# EAGLE design CanBus-Forward (EAGLE 7.4.0)
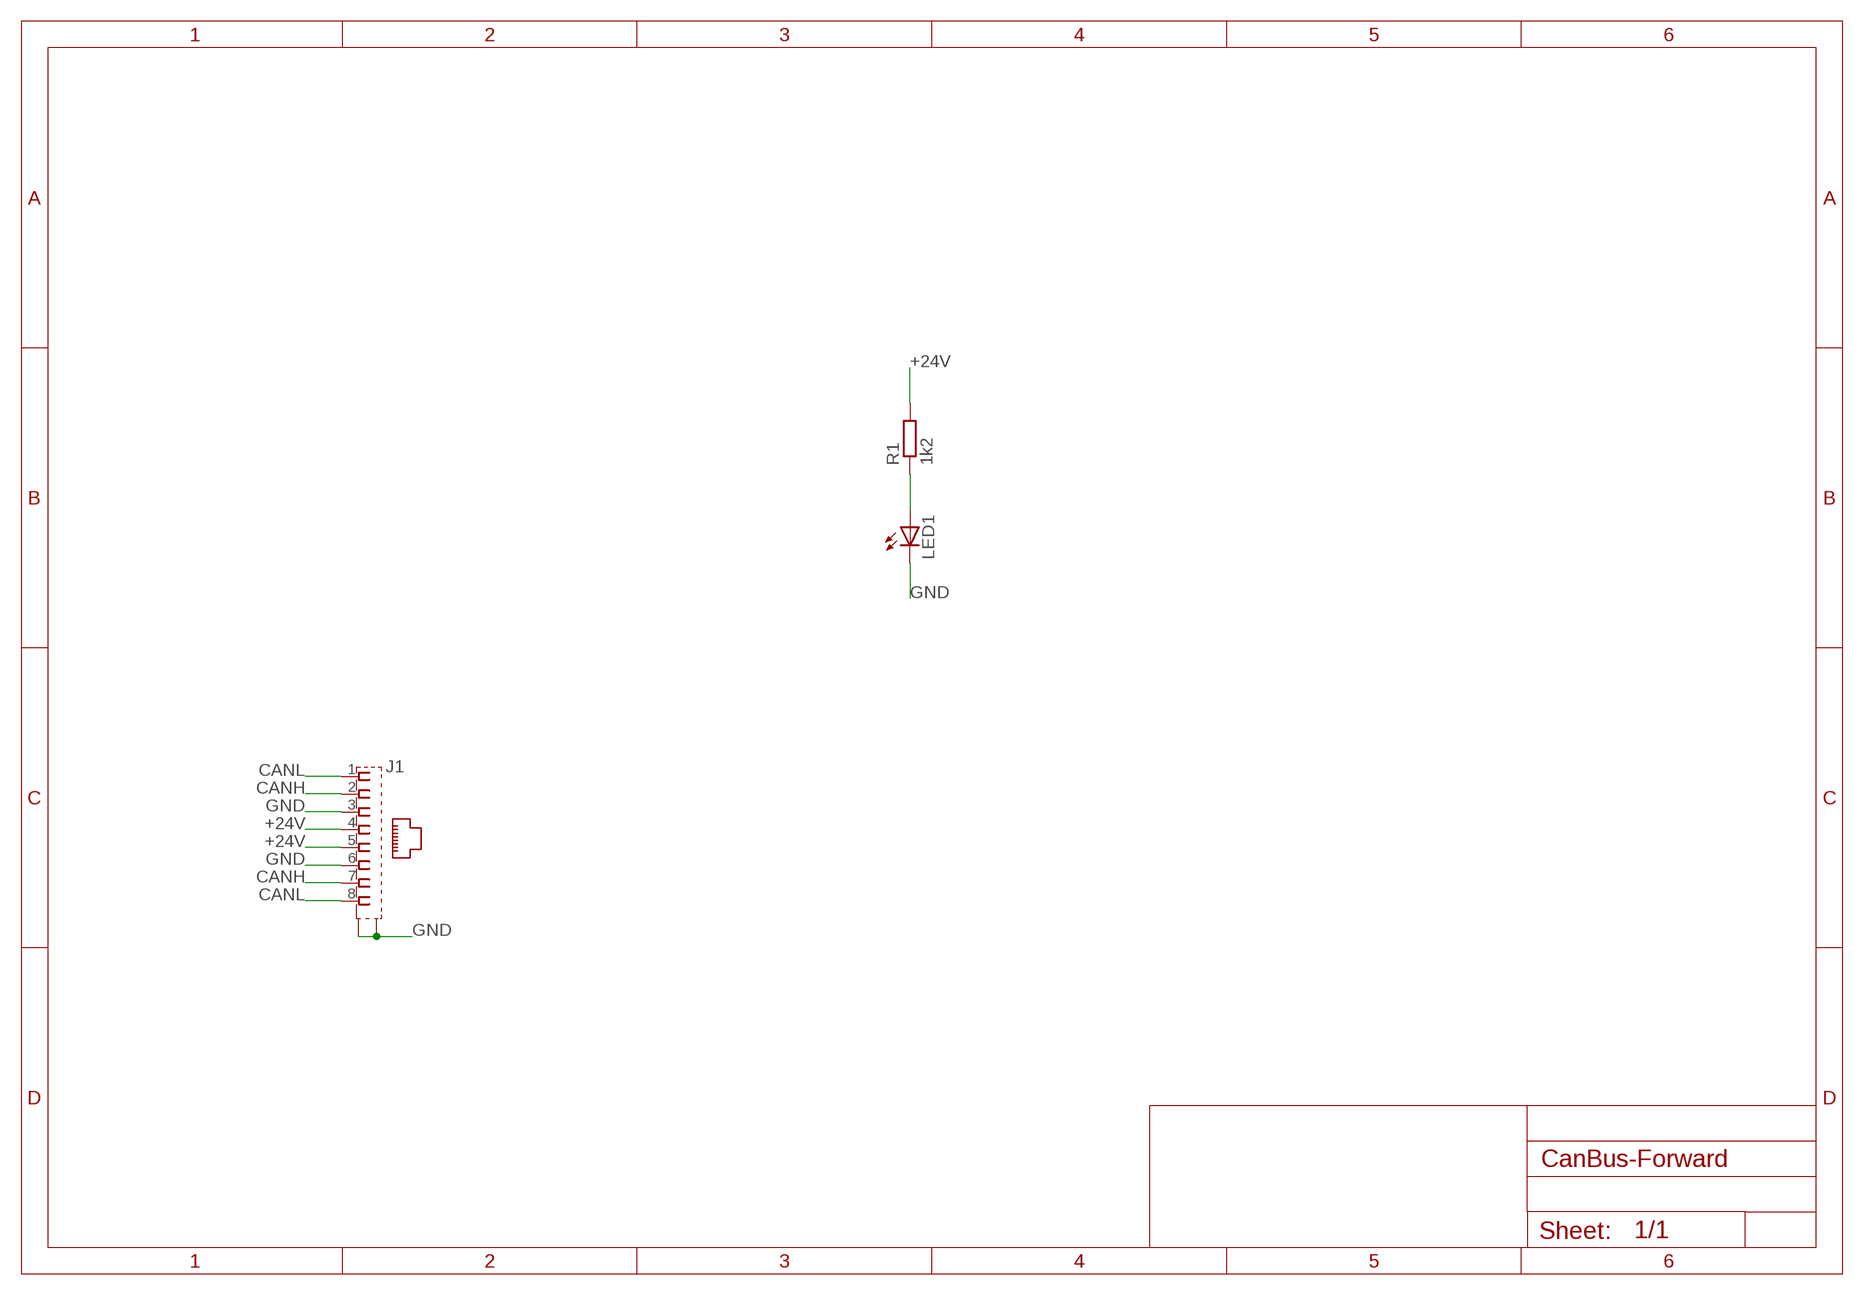
[diagram p0: schematic, sheet 1]

## Parts
J1  555141-1  [MEBP_8-8G]
LED1  LEDCHIPLED_1206  [CHIPLED_1206]
R1  1k2  R-EU_R1206  [R1206]

## Nets
+24V: J1.4 J1.5 R1.2
CANH: J1.2 J1.7
CANL: J1.1 J1.8
GND: J1.3 J1.6 J1.G1(S1) J1.G2(S2) LED1.C
N$2: LED1.A R1.1

## Library data of the parts
J1 = mebp_8-8g:555141-1: AMP connector Reichelt Bestell-Nr. MEBP 8-8G
LED1 = led:LED: LED OSRAM: - CHIPLED LG R971, LG N971, LY N971, LG Q971, LY Q971, LO R971, LY R971 LH N974, LH R974 LS Q976, LO Q976, LY Q976 LO Q996 - Hyper CHIPLED LW Q18S LB Q993, LB Q99A, LB R99A - SideLED LS A670, LO A670, LY A670, LG A670, LP A670 LB A673, LV A673, LT A673, LW A673 LH A674 LY A675 LS A676, LA A676, LO A676, LY A676, LW A676 LS A679, LY A679, LG A679 - Hyper Micro SIDELED® LS Y876, LA Y876, LO Y876, LY Y876 LT Y87S - SmartLED LW L88C, LW L88S LB L89C, LB L89S, LG L890 LS L89K, LO L89K, LY L89K LS L896, LA L896, LO L896, LY L896 - TOPLED LS T670, LO T670, LY T670, LG T670, LP T670 LSG T670, LSP T670, LSY T670, LOP T670, LYG T670 LG T671, LOG T671, LSG T671 LB T673, LV T673, LT T673, LW T673 LH T674 LS T676, LA T676, LO T676, LY T676, LB T676, LH T676, LSB T676, LW T676 LB T67C, LV T67C, LT T67C, LS T67K, LO T67K, LY T67K, LW E67C LS E67B, LA E67B, LO E67B, LY E67B, LB E67C, LV E67C, LT E67C LW T67C LS T679, LY T679, LG T679 LS T770, LO T770, LY T770, LG T770, LP T770 LB T773, LV T773, LT T773, LW T773 LH T774 LS E675, LA E675, LY E675, LS T675 LS T776, LA T776, LO T776, LY T776, LB T776 LHGB T686 LT T68C, LB T68C - Hyper Mini TOPLED® LB M676 - Mini TOPLED Santana® LG M470 LS M47K, LO M47K, LY M47K Source: http://www.osram.convergy.de LUXEON: - LUMILED® LXK2-PW12-R00, LXK2-PW12-S00, LXK2-PW14-U00, LXK2-PW14-V00 LXK2-PM12-R00, LXK2-PM12-S00, LXK2-PM14-U00 LXK2-PE12-Q00, LXK2-PE12-R00, LXK2-PE12-S00, LXK2-PE14-T00, LXK2-PE14-U00 LXK2-PB12-K00, LXK2-PB12-L00, LXK2-PB12-M00, LXK2-PB14-N00, LXK2-PB14-P00, LXK2-PB14-Q00 LXK2-PR12-L00, LXK2-PR12-M00, LXK2-PR14-Q00, LXK2-PR14-R00 LXK2-PD12-Q00, LXK2-PD12-R00, LXK2-PD12-S00 LXK2-PH12-R00, LXK2-PH12-S00 LXK2-PL12-P00, LXK2-PL12-Q00, LXK2-PL12-R00 Source: www.luxeon.com KINGBRIGHT: KA-3528ASYC Source: www.kingbright.com
R1 = rcl:R-EU_: RESISTOR, European symbol

## Board
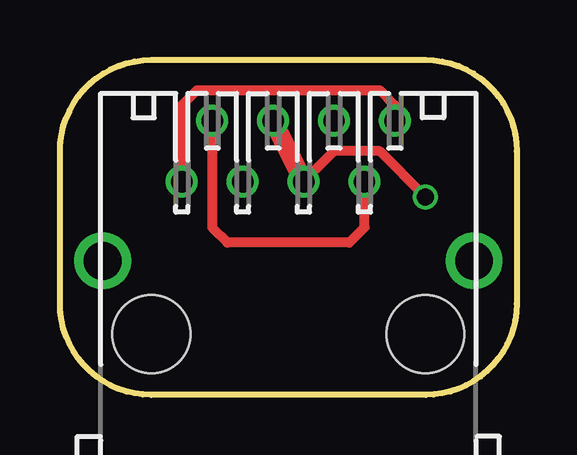
[diagram p1: board, top side]
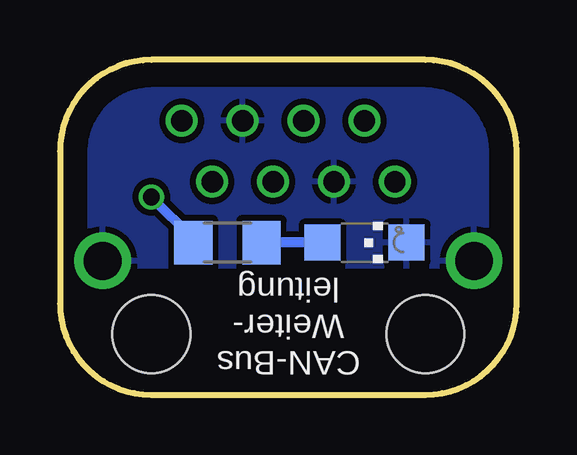
[diagram p2: board, bottom side, seen from below]

Size 19.05 x 13.97 mm. Coordinates in mm from the lower left corner, seen from the top.
Outline: 0,10.16 arc-90 3.81,13.97 15.24,13.97 arc-90 19.05,10.16 19.05,3.81 arc-90 15.24,0 3.81,0 arc-90 0,3.81 0,10.16
Copper layers (1*16): Top 0.035559375mm / dielectric 1.6mm / Bottom 0.035559375mm
Design rules "oshpark-2layer": minimum track width 6mil, minimum drill 10mil, track to track 6mil, track to pad 6mil, pad to pad 6mil, via to via 6mil, smd to smd 6mil, copper to edge 15mil, drill to drill 6mil, minimum pad ring 5mil, minimum via ring 5mil, stop-mask expansion 2.5mil, vias tented up to drill 0mil, thermal gap 10mil

### Footprints (pad centres in the part's own frame; a part is rotated, then mirrored left to right if it is on the bottom)
MEBP_8-8G = drill 0.889: 1 -4.445,6.35; 2 -3.175,8.89; 3 -1.905,6.35; 4 -0.635,8.89; 5 0.635,6.35; 6 1.905,8.89; 7 3.175,6.35; 8 4.445,8.89 | drill 1.575 pad 2.184: G1 -7.745,3.05; G2 7.745,3.05 | hole 3.251: -5.715,0; 5.715,0
CHIPLED_1206 = smd 1.5 x 1.5: A 0,-1.75; C 0,1.75
R1206 = smd 1.6 x 1.803: 1 -1.422,0; 2 1.422,0

### Placement (x,y rotation side)
J1  9.53,2.54 0 top
LED1  6.35,6.35 270 bottom
R1  12.06,6.35 180 bottom

### Tracks (layer width: path | path; a pad name or v marks a point on that pad's centre or on a via)
+24V  (via drill 0.7)
  Top 0.406: v15.24,8.26 13.34,10.16 11.43,10.16 J1.5
  Top 0.813: J1.4 J1.5
  Bottom 0.406: R1.2 13.49,6.5 v15.24,8.26
CANH
  Top 0.406: J1.2 6.35,6.99 6.99,6.35 12.06,6.35 12.7,6.99 J1.7
CANL
  Top 0.406: J1.8 13.97,12.06 13.34,12.7 5.71,12.7 5.08,12.06 J1.1
GND
  pour Bottom (isolate 0.254): 1.27,10.16 arc-90 3.81,12.7 15.24,12.7 arc-90 17.78,10.16 17.78,5.4 1.27,5.4
N$2
  Bottom 0.406: LED1.A R1.1

### Text on the board
bNames: CAN-Bus / Weiter- / leitung